# EAGLE design Simple-PWM-Fan-controller_v2 (EAGLE 7.4.0)
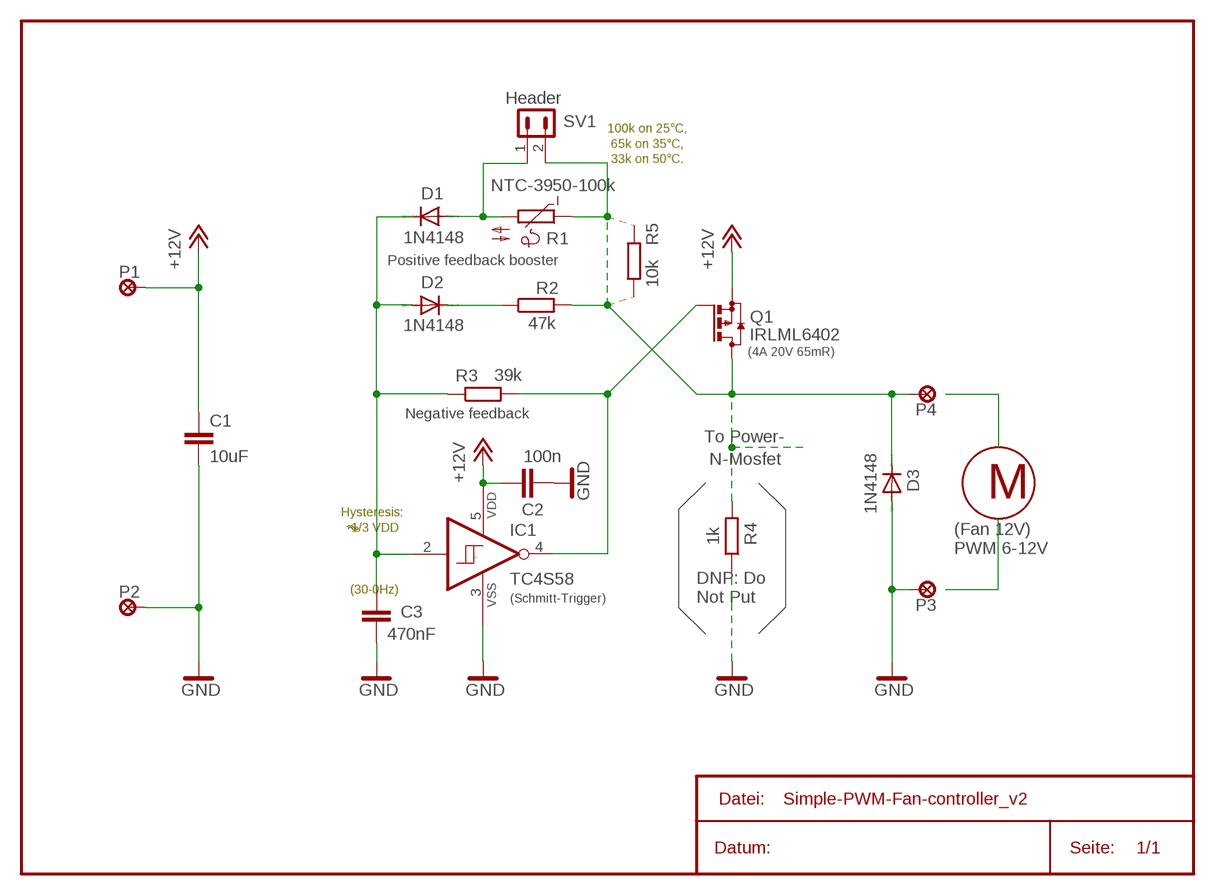
[diagram p0: schematic, sheet 1]

## Parts
C1  10uF  C-EUC1206  [C1206]
C2  100n  C-EUC0603  [C0603]
C3  470nF  C-EUC0603  [C0603]
D1  1N4148  DIODE-SOD323-R  [SOD323-R]
D2  1N4148  DIODE-SOD323-R  [SOD323-R]
D3  1N4148  DIODE-SOD323-R  [SOD323-R]
IC1  TC4S58  TC4S584  [SSOP5P09]
P1  LSP17  [LSP17]
P2  LSP17  [LSP17]
P3  LSP17  [LSP17]
P4  LSP17  [LSP17]
Q1  IRLML6402  BSS8423  [SOT23]
R1  NTC-3950-100k  NTC640  [P640]
R2  47k  R-EU_R0603  [R0603]
R3  39k  R-EU_R0603  [R0603]
R4  1k  R-EU_R0805  [R0805]
R5  10k  R-EU_R0603  [R0603]
SV1  Header  MA02-11  [MA02-1R]

## Nets
+12V: C1.1 C2.1 IC1.5(VDD) P1.P$1(MP) Q1.2(S)
GND: C1.2 C2.2 C3.2 D3.A IC1.3(VSS) P2.P$1(MP) P3.P$1(MP) R4.1
N$1: C3.1 D1.C D2.A IC1.2(I) R3.1
N$2: D1.A R1.2 SV1.1
N$3: D3.C P4.P$1(MP) Q1.3(D) R1.1 R2.2 R4.2 SV1.2
N$4: D2.C R2.1
N$5: IC1.4(O) Q1.1(G) R3.2
Unconnected: R5.1 R5.2

## Notes on the sheet
- 100k on 25°C,
   65k on 35°C,
   33k on 50°C.
- Positive feedback booster
- (4A 20V 65mR)
- Negative feedback
- To Power-
   N-Mosfet
- M
- Hysteresis:
     1/3 VDD
- (Fan 12V)
  PWM 6-12V
- (30-0Hz)
- (Schmitt-Trigger)
- DNP: Do
  Not Put

## Library data of the parts
C1-C3 = rcl1:C-EU: CAPACITOR, European symbol
D1-D3 = diode:DIODE-: DIODE
IC1 = TSSGCMOS:TC4S584: Schmitt-Trigger-Inverter
P1-P4 = solpad-smd:LSP17: SMD Solder-Pad (1.7mm Outer-Ø)
Q1 = transistor-small-signal:BSS84: P-CHANNEL MOS FET
R1 = ptc-ntc:NTC640: PHILIPS NTC; OC_FARNELL: unknown; OC_NEWARK: unknown
R2-R5 = rcl1:R-EU_: RESISTOR, European symbol
SV1 = con-lstc:MA02-1: PIN HEADER

## Board
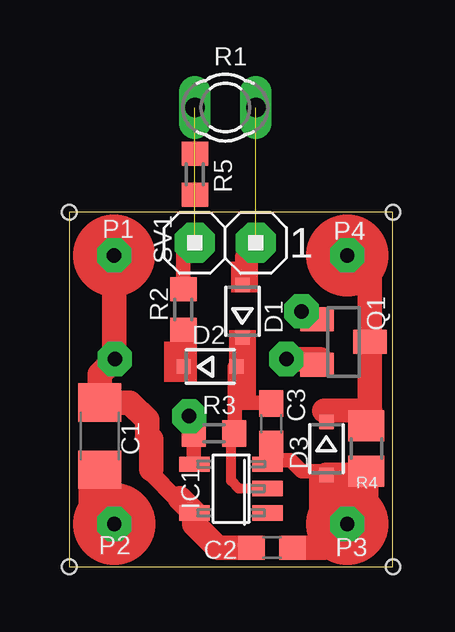
[diagram p1: board, top side]
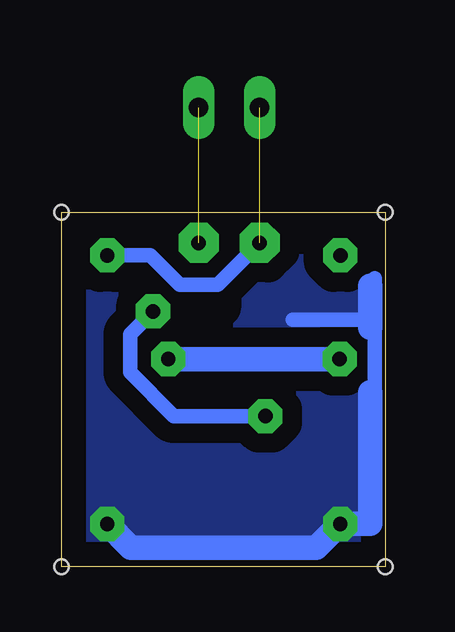
[diagram p2: board, bottom side, seen from below]

Size 13.49 x 14.76 mm. Coordinates in mm from the lower left corner, seen from the top.
Outline: 0,0 13.49,0 13.49,14.76 0,14.76 0,0
Copper layers (1*16): Top 0.035mm / dielectric 1.5mm / Bottom 0.035mm
Design rules "default": minimum track width 10mil, minimum drill 24mil, track to track 8mil, track to pad 8mil, pad to pad 8mil, via to via 8mil, smd to smd 8mil, copper to edge 40mil, drill to drill 8mil, minimum pad ring 10mil, minimum via ring 8mil, stop-mask expansion 4mil, vias tented up to drill 0mil, thermal gap 10mil
Holes 0.6 mm at 0,0 0,14.76 13.49,14.76 13.49,0
bRestrict: area 6.8,10.8 to 7.9,11.7

### Footprints (pad centres in the part's own frame; a part is rotated, then mirrored left to right if it is on the bottom)
C1206 = smd 1.6 x 1.8: 1 -1.4,0; 2 1.4,0
C0603 = smd 1.1 x 1: 1 -0.85,0; 2 0.85,0
SOD323-R = smd 0.6 x 0.6: A 1.1,0; C -1.1,0
SSOP5P09 = smd 0.635 x 1.27: 1 -1.016,-1.524; 2 0,-1.524; 3 1.016,-1.524; 4 1.016,1.524; 5 -1.016,1.524
LSP17 = smd 1.27 x 0.635: P$1 0,0
SOT23 = smd 1 x 1.4: 1 -0.95,-1.1; 2 0.95,-1.1; 3 0,1.1
P640 = drill 0.813 long: 1 -1.27,0; 2 1.27,0
R0603 = smd 1 x 1.1: 1 -0.85,0; 2 0.85,0
R0805 = smd 1.3 x 1.5: 1 -0.95,0; 2 0.95,0
MA02-1R = drill 0.6 pad 1.676 octagon: 1 0,0; 2 2.54,0

### Placement (x,y rotation side)
C1  1.27,5.44 270 top
C2  8.45,0.79 0 top
C3  8.41,5.95 270 top
D1  7.22,10.64 90 top
D2  5.87,8.33 0 top
D3  10.72,4.92 270 top
IC1  6.75,3.25 90 top
P1  1.87,12.97 0 top
P2  1.88,1.78 0 top
P3  11.59,1.78 0 top
P4  11.59,12.97 0 top
Q1  11.43,9.37 270 top
R1  6.51,19.13 0 top  (outside the outline)
R2  4.76,10.72 90 top
R3  6.03,5.56 180 top
R4  12.38,4.92 90 top
R5  5.24,16.35 270 top
SV1  7.78,13.49 180 top

### Tracks (layer width: path | path; a pad name or v marks a point on that pad's centre or on a via)
+12V  (via drill 0.6 pad 1.42)
  Top 0.406: Q1.2 10.36,8.42 10.36,8.46
  Top 0.711: 4.6,2.86 4.45,2.86 3.41,3.89 3.41,4.05
  Top 1.016: 4.6,2.86 IC1.5 5.22,1.76 6.19,0.79 C2.1 | 10.32,8.4 10.36,8.46 10.47,8.65 v9.05,8.65 | P1.P$1 1.87,8.76 v1.91,8.65 1.27,8.02 C1.1 2.53,6.84 3.25,6.11 3.25,5.48 3.41,5.32 3.41,4.05
  Bottom 1.016: v9.05,8.65 v1.91,8.65
  other vias: 1.87,12.97
GND  (via drill 0.6 pad 1.42)
  Top 0.61: IC1.3 8.41,4.43 | 8.41,4.43 C3.2 | 8.41,4.43 9.22,4.43 9.68,3.97 10.72,3.97 D3.A
  Top 1.016: C2.2 10.6,0.79 P3.P$1 12.38,1.78 R4.1 12.38,3.82 D3.A | C1.2 1.27,2.39 P2.P$1
  Bottom 0.61: 1.89,1.73 1.86,1.73 1.86,1.79 | 0.64,7.26 0.44,7.26 0.44,11.71 | 0.44,12.03 0.44,11.75 0.44,11.71 | 3.85,10.28 0.64,10.28 0.64,10.32 | 0.64,11.71 0.44,11.71
  Bottom 1.016: P2.P$1 2.89,0.79 10.6,0.79 P3.P$1 | 1.86,1.79 0.64,1.79 0.64,7.26 | 0.64,9.96 0.64,10.32 0.64,11.71
  other vias: 1.88,1.78 11.59,1.78
  pour Bottom (isolate 0.813): -0.32,15.08 13.81,15.08 13.81,-0.32 -0.32,-0.32
N$1
  Top 0.406: IC1.2 7.06,3.25 6.75,3.57 6.75,5.26 R3.1
  Top 0.61: R3.1 6.89,5.62 6.89,6.83 | C3.1 8.31,6.83 6.89,6.83 | 6.89,6.83 6.89,8.33 D2.A 7.22,8.33 D1.C
N$2  (1 unrouted)
  Top 0.61: SV1.1 7.22,12.94 D1.A
N$3  (via drill 0.6 pad 1.42)  (1 unrouted)
  Top 0.61: R2.2 4.76,13.02 SV1.2 | 10.64,6.5 10.72,6.5 D3.C
  Top 1.016: P4.P$1 12.53,12.03 Q1.3 12.53,5.87 R4.2 12.38,6.51 12.54,6.51 10.64,6.5
  Bottom 0.61: SV1.2 6.99,11.75 8.57,11.75 9.8,12.97 P4.P$1
  other vias: 11.59,12.97
N$4
  Top 0.61: D2.C R2.1
N$5  (via drill 0.6 pad 1.42)
  Top 0.61: v5,6.27 5,5.79 5.08,5.71 R3.2 5.18,4.27 IC1.4 | Q1.1 10,10.32 v9.68,10.64
  Bottom 0.61: v5,6.27 8.81,6.27 10.64,8.1 10.64,9.68 v9.68,10.64
(copper drawn outside any net)
  shapes: Top area x5

### Text on the board
tValues: +12V | Fan+ | GND | Fan-
DNP: (DNP)